# EAGLE design Qwiic_Ninja_Star (EAGLE 9.5.2)
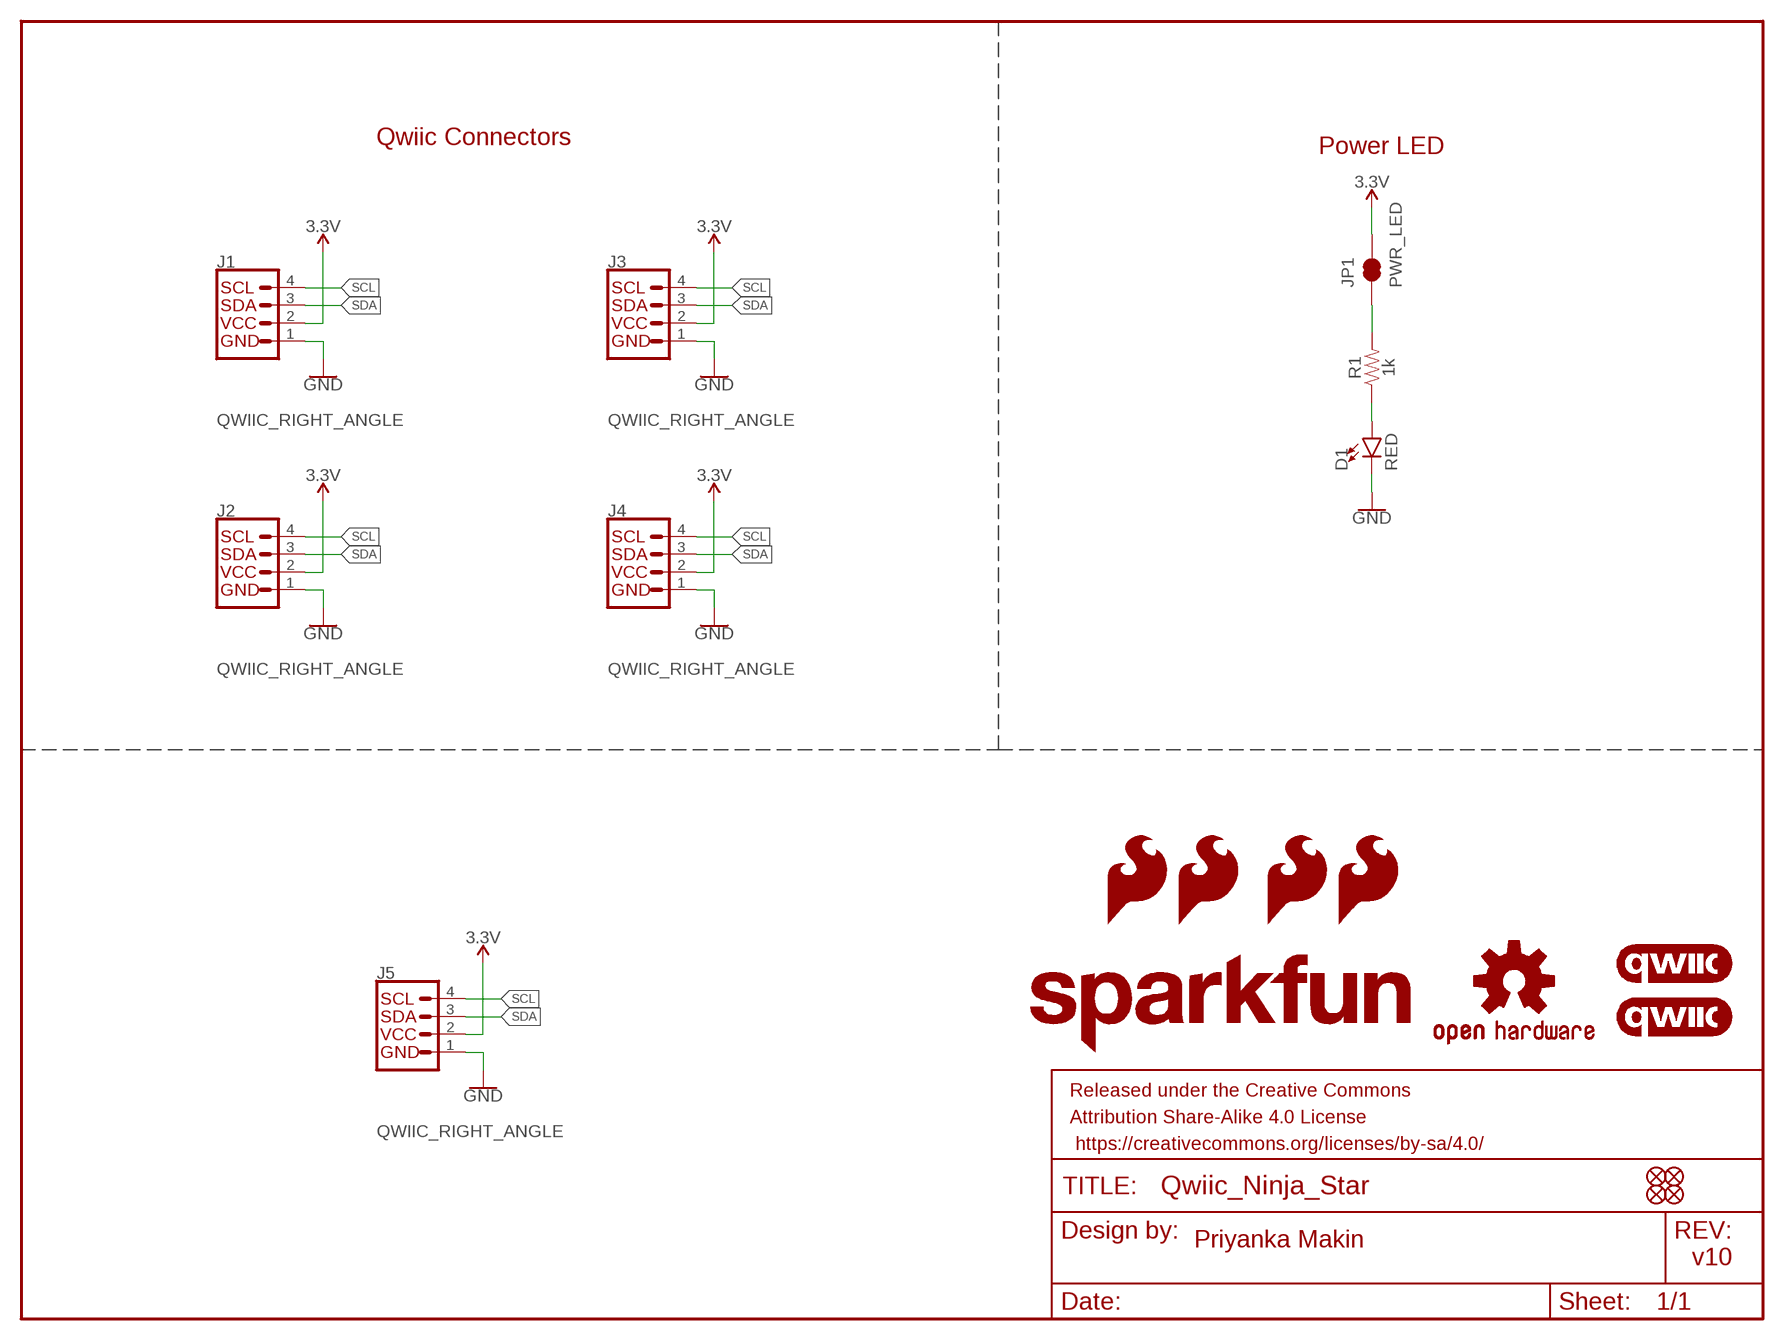
[diagram p0: schematic, sheet 1]

## Parts
D1  RED  LED-RED0603  [LED-0603]
FD1  FIDUCIAL1X2  [FIDUCIAL-1X2]
FD2  FIDUCIAL1X2  [FIDUCIAL-1X2]
FD3  FIDUCIAL1X2  [FIDUCIAL-1X2]
FD4  FIDUCIAL1X2  [FIDUCIAL-1X2]
FRAME1  FRAME-LETTER  [CREATIVE_COMMONS]
J1  QWIIC_RIGHT_ANGLE  QWIIC_CONNECTORJS-1MM  [JST04_1MM_RA]
J2  QWIIC_RIGHT_ANGLE  QWIIC_CONNECTORJS-1MM  [JST04_1MM_RA]
J3  QWIIC_RIGHT_ANGLE  QWIIC_CONNECTORJS-1MM  [JST04_1MM_RA]
J4  QWIIC_RIGHT_ANGLE  QWIIC_CONNECTORJS-1MM  [JST04_1MM_RA]
J5  QWIIC_RIGHT_ANGLE  QWIIC_CONNECTORJS-1MM  [JST04_1MM_RA]
JP1  PWR_LED  JUMPER-SMT_2_NC_TRACE_SILK  [SMT-JUMPER_2_NC_TRACE_SILK]
LOGO1  QWIIC_LOGO_5MM  [QWIIC_5MM]
LOGO2  QWIIC_LOGO_5MM  [QWIIC_5MM]
LOGO3  OSHW-LOGOS  [OSHW-LOGO-S]
LOGO4  SFE_LOGO_NAME.2_INCH  [SFE_LOGO_NAME_.2]
LOGO5  SFE_LOGO_FLAME.1_INCH  [SFE_LOGO_FLAME_.1]
LOGO6  SFE_LOGO_FLAME.1_INCH  [SFE_LOGO_FLAME_.1]
LOGO7  SFE_LOGO_FLAME.1_INCH  [SFE_LOGO_FLAME_.1]
LOGO8  SFE_LOGO_FLAME.1_INCH  [SFE_LOGO_FLAME_.1]
R1  1k  1KOHM-0603-1/10W-1%  [0603]

## Nets
3.3V: J1.2 J2.2 J3.2 J4.2 J5.2 JP1.2
GND: D1.C J1.1 J2.1 J3.1 J4.1 J5.1
N$1: D1.A R1.1
N$2: JP1.1 R1.2
SCL: J1.4 J2.4 J3.4 J4.4 J5.4
SDA: J1.3 J2.3 J3.3 J4.3 J5.3

## Notes on the sheet
- Qwiic Connectors
- Power LED
- Priyanka Makin
- v10

## Library data of the parts
D1 = SparkFun-LED:LED-RED: Red SMD LED Used in manufacturing of most products at SparkFun Packages: 0603 - SMD 0603 package [Product Link] <http://docs.avagotech.com/docs/AV02-0551EN> 0603 SMART - SMD 0603 SMART package ( more efficient and expensive)[Product Link] <http://www.osram-os.com/Graphics/XPic2/00077099_0.pdf> 1206 - SMD1206 package [Product Link] <https://www.sparkfun.com/datasheets/DevTools/LilyPad/Q150OVS4.pdff> SparkFun Products: Pro Mini 328 -5V <https://www.sparkfun.com/products/821> RedBoard <https://www.sparkfun.com/products/12757> IOIO-OTG <https://www.sparkfun.com/products/13613>; PROD_ID: DIO-00819
FD1-FD4 = SparkFun-Aesthetics:FIDUCIAL: Fiducial Alignment Points Point-of-reference for pick-and-place machines and other optical instruments.
FRAME1 = SparkFun-Aesthetics:FRAME-LETTER: Schematic Frame - Letter Standard 8.5x11 US Letter frame
J1-J5 = SparkFun-Connectors:QWIIC_CONNECTOR: SparkFun I2C Standard Qwiic Connector An SMD 1mm pitch JST connector makes it easy and quick (get it? Qwiic?) to connect I2C devices to each other. The Qwiic system <http://www.sparkfun.com/qwiic> enables fast and solderless connection between popular platforms and various sensors and actuators. We carry 200mm <https://www.sparkfun.com/products/14204>, 100mm <https://www.sparkfun.com/products/14205>, 50mm <https://www.sparkfun.com/products/14206>, and breadboard friendly <https://www.sparkfun.com/products/14207> Qwiic cables. We also offer 10 pcs strips <https://www.sparkfun.com/products/14323> the SMD connectors.; PROD_ID: CONN-13694
JP1 = SparkFun-Jumpers:JUMPER-SMT_2_NC_TRACE: Normally closed trace jumper This jumper has a trace between two pads so it's normally closed (NC). Use a razor knife to open the connection. For best results follow the IPC guidelines for cutting traces: Cutout at least 0.063 mm (0.005 in). Remove all loose material to clean up the cut area. Seal the cut with an approved epoxy. Reapply solder to reclose the connection.
LOGO1 LOGO2 = SparkFun-Aesthetics:QWIIC_LOGO: Qwiic Logos for placement on schematic and PCB. The 5.5mm silk logo is best for placing next to Qwiic connector.
LOGO3 = SparkFun-Aesthetics:OSHW-LOGO: Open-Source Hardware (OSHW) Logo This logo indicates the piece of hardware it is found on incorporates a OSHW license and/or adheres to the definition of open source hardware found here: http://freedomdefined.org/OSHW
LOGO4 = SparkFun-Aesthetics:SFE_LOGO_NAME: SparkFun Font Logo This is the SparkFun name logo. The logo on the schematic will always be the same size; the package variant is the height of the flame part of the logo (or the height the flame would be, if it were drawn). Default layer for the logo on the board is tSilk.
LOGO5-LOGO8 = SparkFun-Aesthetics:SFE_LOGO_FLAME: SparkFun Flame Logo This is the SparkFun flame logo. The logo on the schematic will always be the same size; the package variant is the height of the flame. Default layer for the logo on the board is tSilk.
R1 = SparkFun-Resistors:1KOHM: 1kΩ resistor A resistor is a passive two-terminal electrical component that implements electrical resistance as a circuit element. Resistors act to reduce current flow, and, at the same time, act to lower voltage levels within circuits. - Wikipedia; PROD_ID: RES-07856

## Board
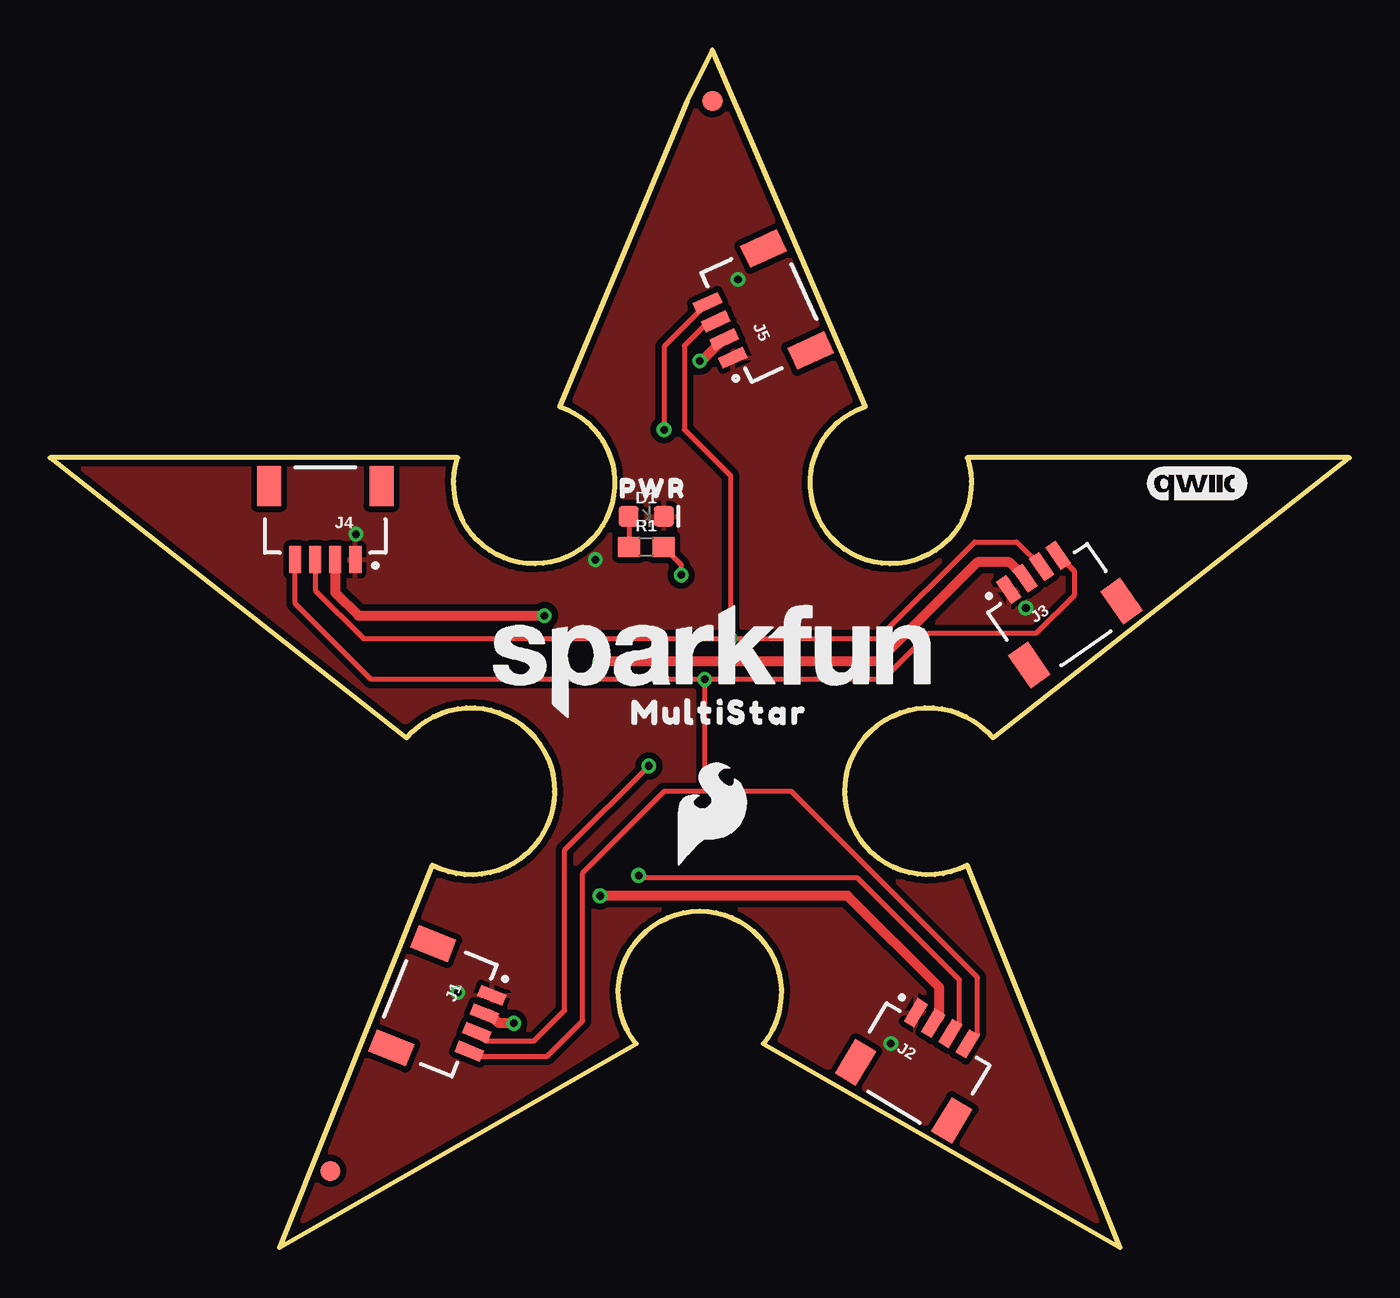
[diagram p1: board, top side]
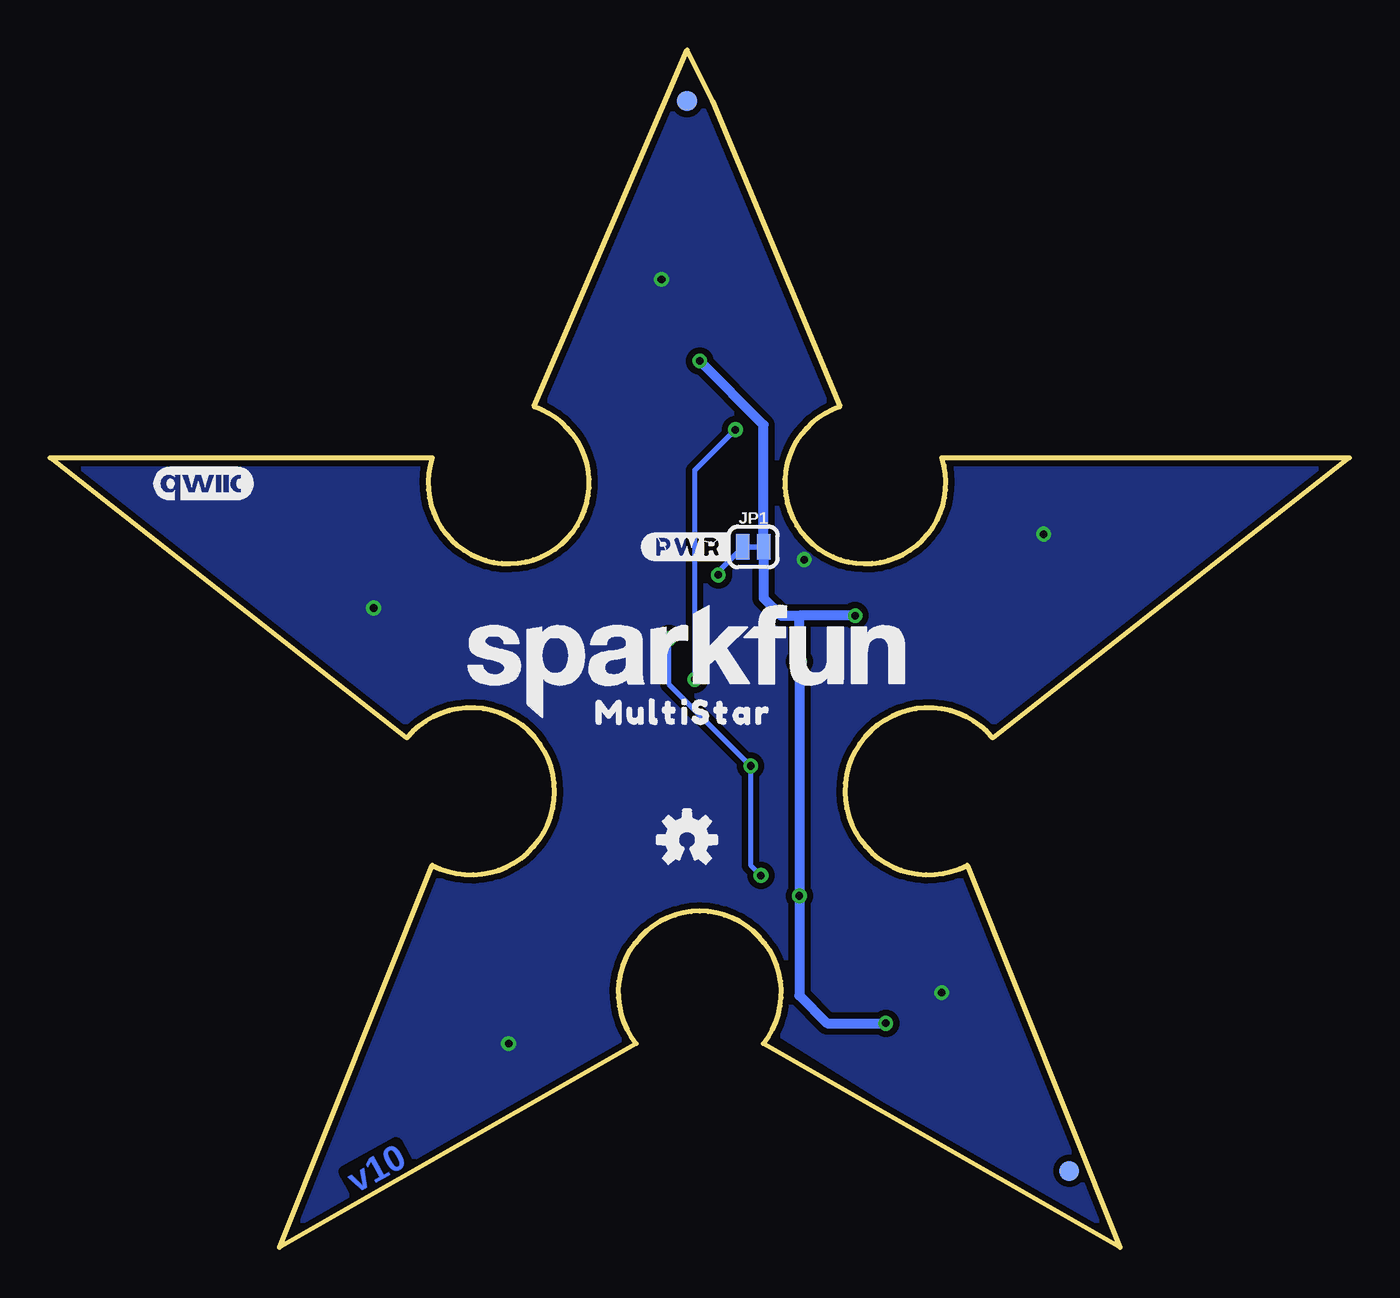
[diagram p2: board, bottom side, seen from below]

Size 64.77 x 59.69 mm. Coordinates in mm from the lower left corner, seen from the top.
Outline: 31.75,57.15 25.4,41.91 arc-270 20.32,39.37 0,39.37 17.78,25.4 arc-258 19.05,19.05 11.43,0 29.21,10.16 arc-257 35.56,10.16 53.34,0 45.72,19.05 arc-258 46.99,25.4 64.77,39.37 45.72,39.37 arc-270 40.64,41.91 33.02,59.69 31.75,57.15
Copper layers (1*16): Top 0.035mm / dielectric 1.5mm / Bottom 0.035mm
Design rules "SparkFun-2-Layer-General-JLCPCB": minimum track width 7mil, minimum drill 0.3mm, track to track 7mil, track to pad 7mil, pad to pad 7mil, via to via 7mil, smd to smd 7mil, copper to edge 7mil, drill to drill 7mil, minimum pad ring 7mil, minimum via ring 7mil, stop-mask expansion 3mil, vias tented up to drill 25mil, thermal gap 10mil

### Footprints (pad centres in the part's own frame; a part is rotated, then mirrored left to right if it is on the bottom)
LED-0603 = smd 1 x 1: A -0.877,0; C 0.877,0
FIDUCIAL-1X2 = smd 1 x 1: 1 0,0
JST04_1MM_RA = smd 0.6 x 1.35: 1 -1.5,0; 2 -0.5,0; 3 0.5,0; 4 1.5,0 | smd 1.2 x 2: NC1 2.8,-3.675; NC2 -2.8,-3.675
SMT-JUMPER_2_NC_TRACE_SILK = smd 0.66 x 1.27: 1 -0.521,0; 2 0.521,0
0603 = smd 1.1 x 1: 1 -0.85,0; 2 0.85,0

### Placement (x,y rotation side)
D1  29.72,36.45 0 top
FD1  13.97,3.81 0 top
FD2  13.97,3.81 0 bottom
FD3  33.02,57.15 0 top
FD4  33.02,57.15 0 bottom
FRAME1  21.59,-8.89 0 top  (outside the outline)
J1  21.46,11.18 248.1 top
J2  44.45,10.92 328.9 top
J3  49.02,33.66 34.7 top
J4  13.72,34.29 180 top
J5  33.4,45.72 114.8 top
JP1  29.72,34.92 0 bottom
LOGO1  57.15,38.1 0 bottom
LOGO2  57.15,38.1 0 top
LOGO3  33.02,20.32 0 bottom
LOGO4  33.02,29.21 0 bottom
LOGO5  SFE_LOGO_NAME.2_INCH  [SFE_LOGO_NAME_.2]  33.02,29.21 0 top
R1  29.72,34.92 0 top
U$2  [SFE_LOGO_FLAME_.2]  33.02,21.59 0 top
U$3  [MULTISTAR0]  28.07,26.67 0 top
U$5  [MULTISTAR0]  38.48,26.67 0 bottom
U$6  [#PWR#0]  35.31,34.92 0 bottom
U$9  [PWR0]  27.69,37.85 0 top

### Tracks (layer width: path | path; a pad name or v marks a point on that pad's centre or on a via)
3.3V  (via drill 0.38)
  Top 0.508: J4.2 14.22,32.65 15.37,31.5 v24.64,31.5 | J1.2 21.9,11.64 22.37,11.18 v23.11,11.18 | J5.2 33.55,45.27 32.48,44.2 v32.38,44.2 | J2.2 44.32,11.48 44.32,12.95 39.75,17.53 v27.42,17.53 | J3.2 47.82,34.16 46.23,34.16 41.27,29.21 v27.42,29.21
  Bottom 0.508: v23.11,11.18 26.04,11.18 27.42,12.56 v27.42,17.53 v27.42,29.21 27.42,31.5 | v32.38,44.2 29.2,41.01 JP1.2 29.2,32.37 28.32,31.5 27.42,31.5 | v24.64,31.5 27.42,31.5
GND  (via drill 0.38)
  other vias: 15.24,35.56 27.18,34.29 34.29,48.26 48.64,31.88 41.91,10.16 20.32,12.7
  pour Top (isolate 0.305): 0,39.37 24.13,39.37 33.02,59.69 41.91,39.37 64.77,39.37 44.45,22.86 53.34,0 31.75,12.7 11.43,0 20.32,22.86
  pour Bottom (isolate 0.305): 0,39.37 24.13,39.37 33.02,59.69 41.91,39.37 64.77,39.37 44.45,22.86 53.34,0 31.75,12.7 11.43,0 20.32,22.86
N$1
  Top 0.254: D1.A 28.87,36.42 R1.1
N$2  (via drill 0.38)
  Top 0.254: R1.2 31.46,34.03 v31.46,33.53
  Bottom 0.254: JP1.1 31.46,33.71 v31.46,33.53
SCL  (via drill 0.38)
  Top 0.254: J3.4 51.05,33.71 51.05,32.51 49.15,30.61 43.81,30.61 41.53,28.32 v32.64,28.32 | J4.4 12.22,32.11 16,28.32 v32.64,28.32 | J5.4 30.61,44.92 v30.61,40.77 | J1.4 21.16,9.53 24.77,9.53 26.54,11.3 26.54,18.67 30.61,22.73 32.64,22.73 | 32.64,22.73 v32.64,28.32 | J2.4 46.23,10.64 46.23,13.46 36.96,22.73 32.64,22.73
  Bottom 0.254: v30.61,40.77 32.64,38.73 v32.64,28.32
SDA  (via drill 0.38)
  Top 0.254: J4.3 13.22,32.76 15.62,30.35 v33.91,30.35 | J3.3 48.19,35.18 46.1,35.18 41.27,30.35 v33.91,30.35 | J1.3 21.7,10.29 24.13,10.29 25.65,11.81 25.65,19.81 v29.84,24 | J2.3 45.34,11.12 45.34,13.34 40.26,18.41 29.46,18.41 v29.34,18.54 | v33.91,30.35 33.91,38.48 31.62,40.77 31.62,44.96 32.59,45.92 32.94,45.92 J5.3
  Bottom 0.254: v33.91,30.35 33.91,28.07 v29.84,24 29.84,19.05 v29.34,18.54

### Text on the board
Bottom: v10
tDocu: Priyanka Makin